# Altium project FDRV_1.0.PrjPCB
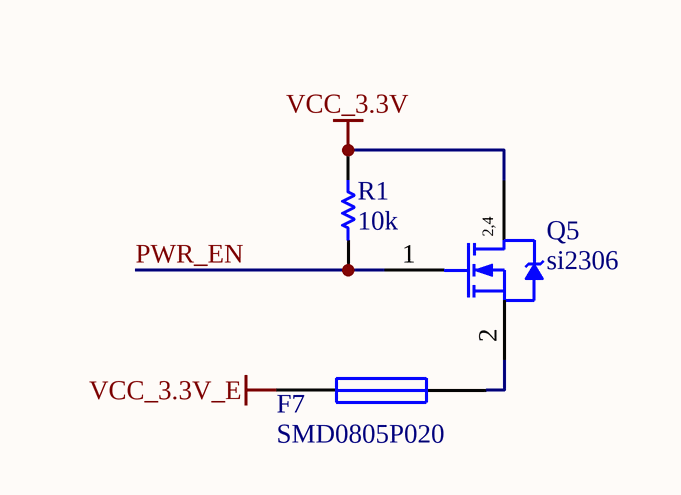
[diagram p0: Connector.SchDoc]
5 sheets, 72 parts. Net scope: global (net labels, ports and power ports of the same name join across sheets).
Board file: PCB1.PcbDoc
Sheets:
  Connector.SchDoc
  cpu.SchDoc
  RS485.SchDoc
  Humidifier.SchDoc
  POWER.SchDoc

## Sheet Connector.SchDoc
size A3

### Parts
F7  SMD0805P020  [1206R]
Q5  si2306  [SOT23-3]
R1  10k  [0603r]

### Nets
VCC_3.3V: Q5.3(D) R1.1
VCC_3.3V_E: F7.1
PWR_EN: Q5.1(G) R1.2
NetF7_2: F7.2 Q5.2(S)

### Notes on the sheet
- (in symbol BUK92150-55A) 2,4

### Library data of the parts
F7 = Fuse 1: Fuse; Published: 8-Jun-2000; LatestRevisionDate: 17-Jul-2002; LatestRevisionNote: Re-released for DXP Platform.; PackageReference: PIN-W2/E2.8; Publisher: Altium Limited
Q5 = BUK92150-55A: Published: 8-Jun-2000; LatestRevisionDate: 17-Jul-2002; LatestRevisionNote: Re-released for DXP Platform.; DatasheetVersion: 6-Oct-1997; PackageVersion: Aug-1998; PackageReference: TSOP-6; Publisher: Altium Limited; PackageDescription: SOT-457/SC-74; 6 Leads; Body 3.1 x 3 mm, inc. leads (LxW max); ComponentLink1Description: Manufacturer Link; ComponentLink1URL: http://www.vishay.com/; ComponentLink2Description: Datasheet; ComponentLink2URL: http://www.vishay.com/docs/70192/70192.pdf
R1 = Res1: Resistor; Value: 1K; Published: 8-Jun-2000; LatestRevisionDate: 17-Jul-2002; LatestRevisionNote: Re-released for DXP Platform.; PackageReference: AXIAL-0.3; Publisher: Altium Limited

## Sheet cpu.SchDoc
size A3
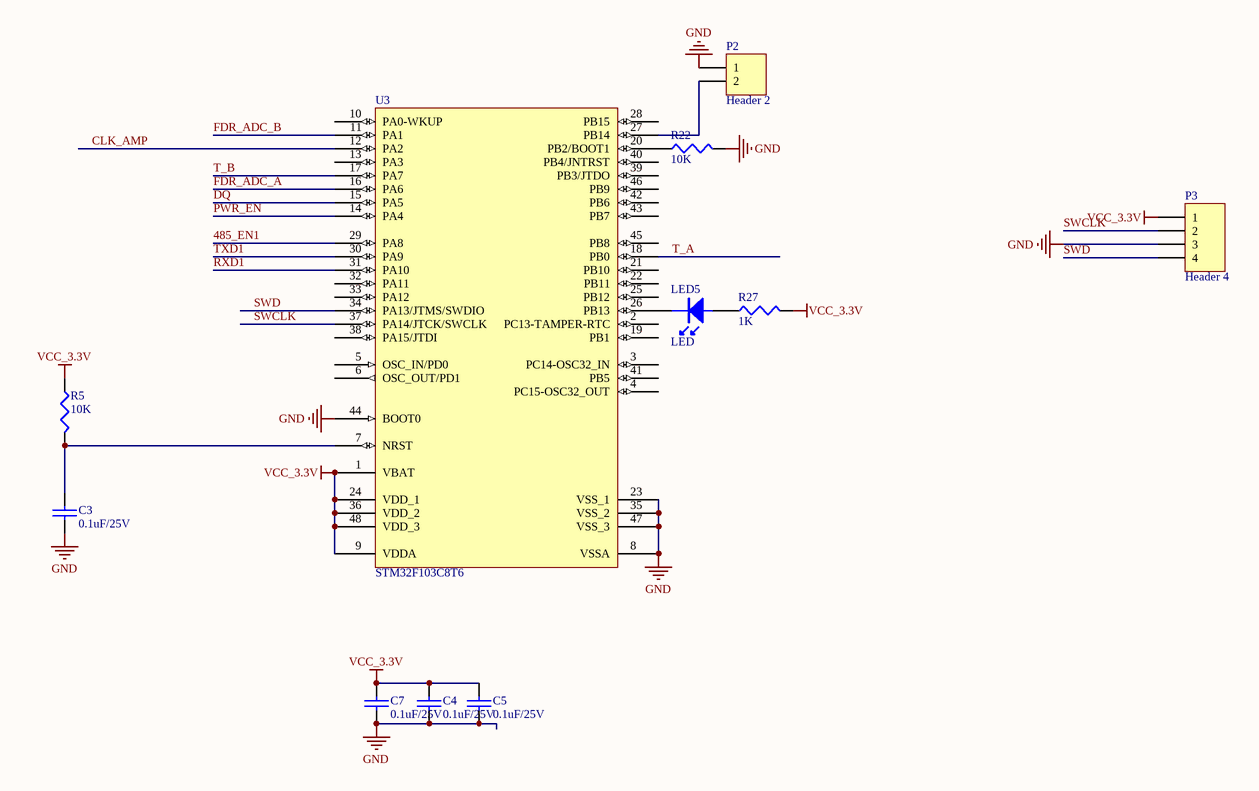
[diagram p1: cpu.SchDoc]

### Parts
C3  0.1uF/25V  [0603C]
C4  0.1uF/25V  [0603C]
C5  0.1uF/25V  [0603C]
C7  0.1uF/25V  [0603C]
LED5  LED  [0603LED]
P2  Header 2  [HDR1X2]
P3  Header 4  [HDR1X4]
R5  10K  [0603R]
R22  10K  [0603R]
R27  1K  [0603R]
U3  STM32F103C8T6  [TQFP-48]

### Nets
GND: C3.1 C4.1 C5.1 C7.1 P2.1 P3.3 R22.2 U3.8(VSSA) U3.23(VSS_1) U3.35(VSS_2) U3.44(BOOT0) U3.47(VSS_3)  [project net AGND]
VCC_3.3V: C4.2 C5.2 C7.2 P3.1 R5.1 R27.2 U3.1(VBAT) U3.9(VDDA) U3.24(VDD_1) U3.36(VDD_2) U3.48(VDD_3)
485_EN1: U3.29(PA8)
CLK_AMP: U3.12(PA2)
DQ: U3.15(PA5)
FDR_ADC_A: U3.16(PA6)
FDR_ADC_B: U3.11(PA1)
PWR_EN: U3.14(PA4)
RXD1: U3.31(PA10)
SWCLK: P3.2 U3.37(PA14/JTCK/SWCLK)
SWD: P3.4 U3.34(PA13/JTMS/SWDIO)
T_A: U3.18(PB0)
T_B: U3.17(PA7)
TXD1: U3.30(PA9)
NetC3_2: C3.2 R5.2 U3.7(NRST)
NetLED5_1: LED5.1 R27.1
NetLED5_2: LED5.2 U3.26(PB13)
NetP2_2: P2.2 U3.27(PB14)
NetR22_1: R22.1 U3.20(PB2/BOOT1)

Not connected (* = marked no-connect by the designer): U3 2(PC13-TAMPER-RTC) 3(PC14-OSC32_IN) 4(PC15-OSC32_OUT) 5(OSC_IN/PD0) 6(OSC_OUT/PD1) 10(PA0-WKUP) 13(PA3) 19(PB1) 21(PB10) 22(PB11) 25(PB12) 28(PB15) 32(PA11) 33(PA12) 38(PA15/JTDI) 39(PB3/JTDO) 40(PB4/JNTRST) 41(PB5) 42(PB6) 43(PB7) 45(PB8) 46(PB9)

### Library data of the parts
C3-C5 C7 = CAP: Capacitor
P2 = Header 2: Header, 2-Pin; LatestRevisionDate: 17-Jul-2002; LatestRevisionNote: Re-released for DXP Platform.; Publisher: Altium Limited
P3 = Header 4: Header, 4-Pin; LatestRevisionDate: 17-Jul-2002; LatestRevisionNote: Re-released for DXP Platform.; Publisher: Altium Limited
R5 R22 = Res3: Resistor; Published: 8-Jun-2000; LatestRevisionDate: 29-May-2009; LatestRevisionNote: IPC-7351 Footprint Added.; PackageReference: J1-0603; Publisher: Altium Limited; PackageDescription: Chip Resistor
R27 = RES1: P: 1/8W
U3 = STM32F103C8T6: STM32 ARM-based 32-bit MCU with 64 Kbytes Flash, 48-pin LQFP, Industrial Temperature; Published: 30-May-2008; DatasheetVersion: rev6, Mar-2008; PackageVersion: Mar-2008; PackageReference: LQFP48; Publisher: Altium Limited; PackageDescription: 48-Pin Low-Profile Quad Flat Pack, 7 x 7 mm Body, 0.5 mm Pitch (LQFP48); ComponentLink1Description: Manufacturer Link; ComponentLink1URL: www.st.com/stm32; ComponentLink2Description: Datasheet; ComponentLink2URL: http://www.st.com/stonline/products/literature/ds/13587.pdf

## Sheet RS485.SchDoc
size A4
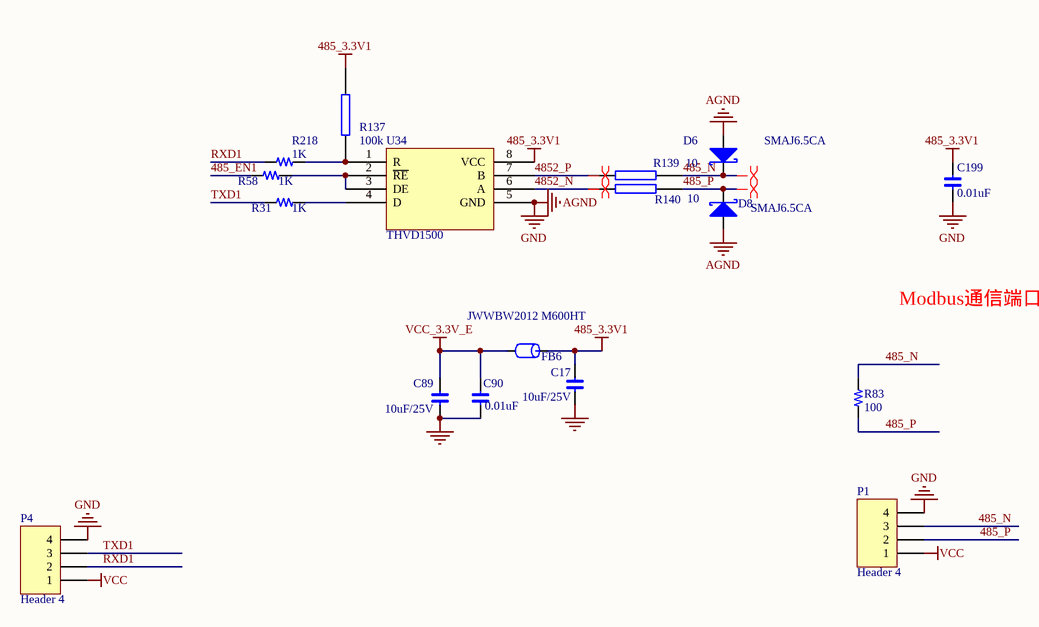
[diagram p2: RS485.SchDoc]

### Parts
C17  10uF/25V  [0603C]
C89  10uF/25V  [0603C]
C90  0.01uF  [0603C]
C199  0.01uF  [0603C]
D6  SMAJ6.5CA  [SMA]
D8  SMAJ6.5CA  [SMA]
FB6  JWWBW2012 M600HT  [0805CZ]
P1  Header 4  [HDR1X4]
P4  Header 4  [HDR1X4]
R31  1K  [0603R]
R58  1K  [0603R]
R83  100  [0603R]
R137  100k  [0603R]
R139  10  [1206R]
R140  10  [1206R]
R218  1K  [0603R]
U34  THVD1500  [so-8]

### Nets
485_3.3V1: C17.2 C199.2 FB6.1 R137.2 U34.8(VCC)
AGND: C17.1 C89.1 C90.1 C199.1 D6.1(A) D8.1(A) P1.4 P4.4 U34.5(GND)  [also labelled GND]
VCC: P1.1 P4.1
VCC_3.3V_E: C89.2 C90.2 FB6.2
485_EN1: R58.2
485_N: D6.2(K) P1.3 R83.2 R139.1
485_P: D8.2(K) P1.2 R83.1 R140.1
4852_N: R140.2 U34.6(A)
4852_P: R139.2 U34.7(B)
RXD1: P4.2 R218.2
TXD1: P4.3 R31.2
NetR31_1: R31.1 U34.4(D)
NetR58_1: R58.1 U34.2(~{RE}) U34.3(DE)
NetR137_1: R137.1 R218.1 U34.1(R)

### Layout directives
differential pair: 485_N, 485_P, 4852_N, 4852_P

### Notes on the sheet
- Modbus通信端口

### Library data of the parts
C17 C89 C90 C199 = C
D6 D8 = DIODE S: Schottky Diode
FB6 = FB: Part Field 1: 磁珠/0603/1K ohm/100MHz; FB: BLM18BD102SN1(muRata); Text Field1: FB
P1 P4 = Header 4: Header, 4-Pin; LatestRevisionDate: 17-Jul-2002; LatestRevisionNote: Re-released for DXP Platform.; Publisher: Altium Limited
R31 R58 R83 R218 = R
R137 R139 R140 = RES2
U34 = SN65HVD06D

## Sheet Humidifier.SchDoc
size A2; PageSetup: Record=PageOptions|CenterHorizontal=True|CenterVertical=True|PrintScale=1.00|XCorrection=1.00|YCorrection=1.00|PrintKind=0|BorderSize=5000000|LeftOffset=0|BottomOffset=0|Orientation=2|PaperLength=1000|PaperWidth=1000|Scale=100|PaperSource=7|PrintQuality=-4|MediaType=1|DitherType=10|PaperKind=A4|PrintScaleMode=1
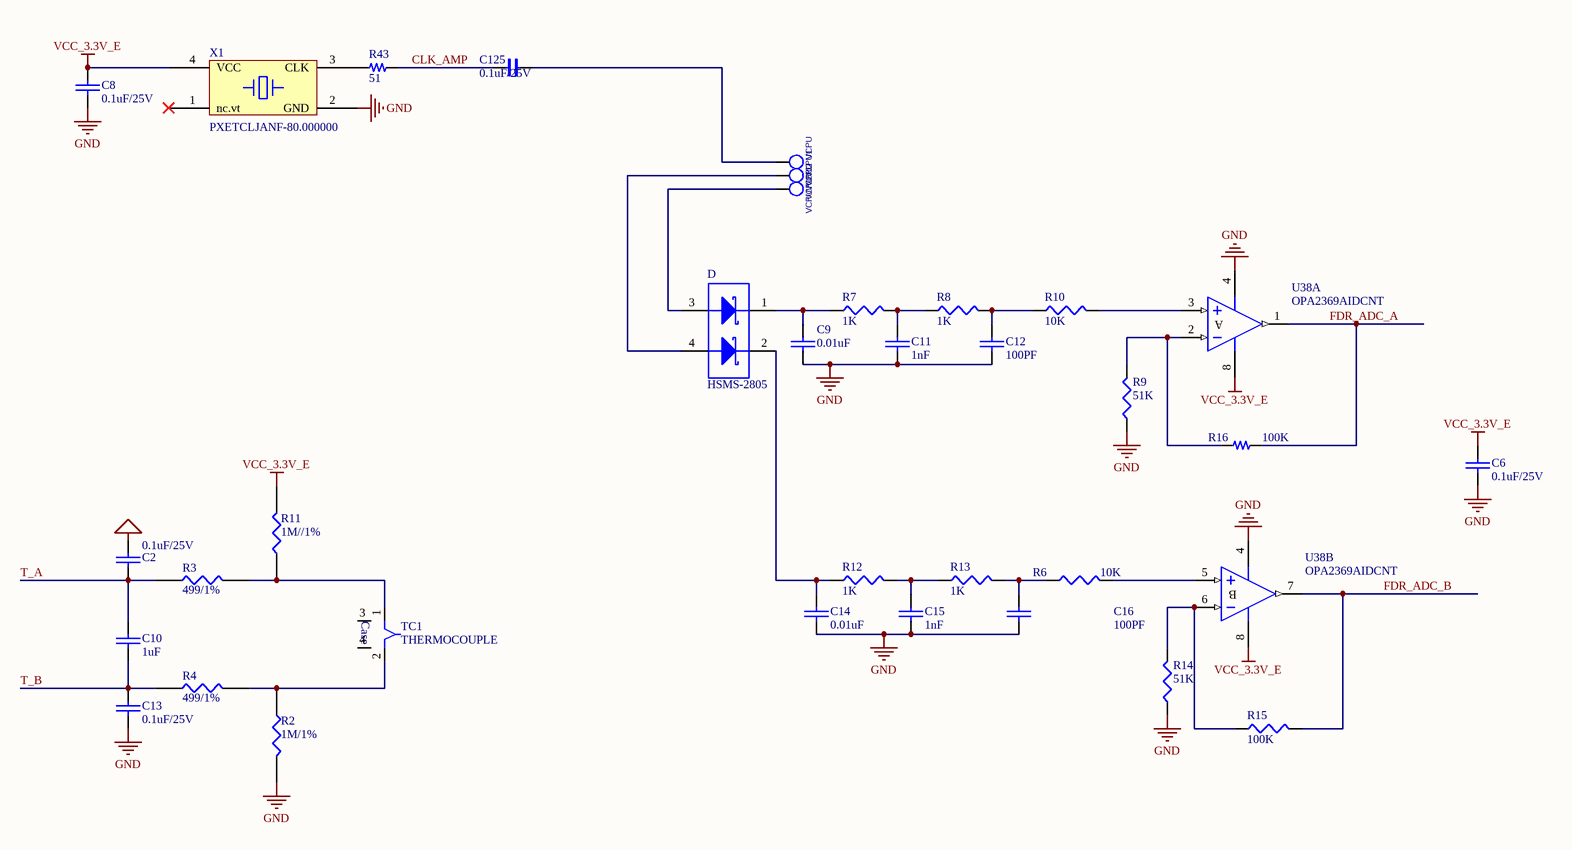
[diagram p3: Humidifier.SchDoc]

### Parts
C2  0.1uF/25V  [0603c]
C6  0.1uF/25V  [0603C]
C8  0.1uF/25V  [0603C]
C9  0.01uF  [0603C]
C10  1uF  [0603c]
C11  1nF  [0603C]
C12  100PF  [0603C]
C13  0.1uF/25V  [0603c]
C14  0.01uF  [0603C]
C15  1nF  [0603C]
C16  100PF  [0603C]
C125  0.1uF/25V  [0603C]
D  HSMS-2805  [HSMS-2805]
R2  1M/1%  [0603r]
R3  499/1%  [0603r]
R4  499/1%  [0603r]
R6  10K  [0603R]
R7  1K  [0603R]
R8  1K  [0603R]
R9  51K  [0603R]
R10  10K  [0603R]
R11  1M//1%  [0603r]
R12  1K  [0603R]
R13  1K  [0603R]
R14  51K  [0603R]
R15  100K  [0603R]
R16  100K  [0603R]
R43  51  [0603r]
TC1  THERMOCOUPLE  [0603R]
U38  OPA2369AIDCNT  [OPA2369AIDCNT]  (parts A,B of 2)
VCPU  VCPU  [probe]
VCPU1  VCPU  [probe]
VCPU2  VCPU  [probe]
X1  PXETCLJANF-80.000000  [XTAL4TN_7050]

### Nets
GND: C2.2 C6.1 C8.2 C9.2 C11.2 C12.2 C13.2 C14.2 C15.2 C16.2 R2.2 R9.1 R14.1 U38.4(V-) X1.2(GND)  [project net AGND]
VCC_3.3V_E: C6.2 C8.1 R11.2 U38.8(V+) X1.4(VCC)
CLK_AMP: C125.1 R43.2
FDR_ADC_A: R16.2 U38.1(OUT)
FDR_ADC_B: R15.2 U38.7(OUT)
T_A: C2.1 C10.1 R3.1
T_B: C10.2 C13.1 R4.1
NetC9_1: C9.1 D.1(K) R7.1
NetC11_1: C11.1 R7.2 R8.1
NetC12_1: C12.1 R8.2 R10.1
NetC14_1: C14.1 D.2(K) R12.1
NetC15_1: C15.1 R12.2 R13.1
NetC16_1: C16.1 R6.1 R13.2
NetC125_2: C125.2 VCPU.1(TP)
NetD_3: D.3(A) VCPU2.1(TP)
NetD_4: D.4(A) VCPU1.1(TP)
NetR2_1: R2.1 R4.2 TC1.2
NetR3_2: R3.2 R11.1 TC1.1
NetR6_2: R6.2 U38.5(IN+)
NetR9_2: R9.2 R16.1 U38.2(IN-)
NetR10_2: R10.2 U38.3(IN+)
NetR14_2: R14.2 R15.1 U38.6(IN-)
NetR43_1: R43.1 X1.3(CLK)

Not connected (* = marked no-connect by the designer): TC1 3 4; X1 1(nc.vt)*

### Notes on the sheet
- (in symbol LM2904D, part A) A
- (in symbol LM2904D, part B) B
- (in symbol THERMOCOUPLE) Case

### Library data of the parts
C2 C6 C8-C16 = CAP: Capacitor
C125 = C
R2-R4 R11 = RES1
R6-R10 R12-R15 = Res3: Resistor; Published: 8-Jun-2000; LatestRevisionDate: 29-May-2009; LatestRevisionNote: IPC-7351 Footprint Added.; PackageReference: J1-0603; Publisher: Altium Limited; PackageDescription: Chip Resistor
R16 R43 = R
U38 = LM2904D: Dual Operational Amplifier; Published: 16-Jan-2001; LatestRevisionDate: 13-Apr-2006; LatestRevisionNote: IPC-7351 Footprint Added.; DatasheetVersion: Jul-1998; PackageVersion: Jan-1998; PackageReference: D008; Publisher: Altium Limited; PackageDescription: 8-Pin Small Outline Integrated Circuit 1.27 mm Pitch; Code_IPC: SOIC127P600-8; ComponentLink1Description: Manufacturer Link; ComponentLink1URL: http://www.ti.com/; ComponentLink2Description: Datasheet; ComponentLink2URL: http://www-s.ti.com/sc/ds/lm2904.pdf
VCPU VCPU1 VCPU2 = T_POINT_R
X1 = XTAL4S

## Sheet POWER.SchDoc
size A3
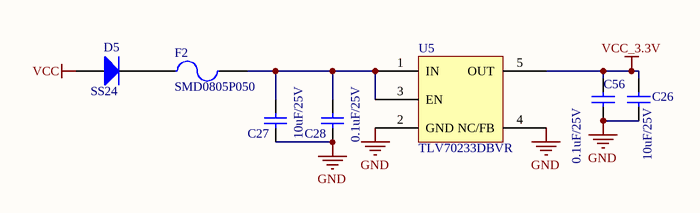
[diagram p4: POWER.SchDoc]

### Parts
C26  10uF/25V  [0603C]
C27  10uF/25V  [0603C]
C28  0.1uF/25V  [0603C]
C56  0.1uF/25V  [0603C]
D5  SS24  [SMA]
F2  SMD0805P050  [0805R]
U5  TLV70233DBVR  [SOT23-5(DBV)]

### Nets
GND: C26.1 C27.1 C28.2 C56.2 U5.2(GND) U5.4(NC/FB)  [project net AGND]
VCC: D5.1(A)
VCC_3.3V: C26.2 C56.1 U5.5(OUT)
NetC27_2: C27.2 C28.1 F2.2 U5.1(IN) U5.3(EN)
NetD5_2: D5.2(K) F2.1

### Library data of the parts
C26 = Cap: Capacitor; Value: 10uF/10V; Published: 8-Jun-2000; LatestRevisionDate: 17-Jul-2002; LatestRevisionNote: Re-released for DXP Platform.; PackageReference: RAD-0.3; Publisher: Altium Limited
C27 = Cap: Capacitor; Value: 106/50V; Published: 8-Jun-2000; LatestRevisionDate: 17-Jul-2002; LatestRevisionNote: Re-released for DXP Platform.; PackageReference: RAD-0.3; Publisher: Altium Limited
C28 C56 = Cap: Capacitor; Value: 104; Published: 8-Jun-2000; LatestRevisionDate: 17-Jul-2002; LatestRevisionNote: Re-released for DXP Platform.; PackageReference: RAD-0.3; Publisher: Altium Limited
D5 = Diode 1N4148: High Conductance Fast Diode; Published: 8-Jun-2000; LatestRevisionDate: 17-Jul-2002; LatestRevisionNote: Re-released for DXP Platform.; DatasheetVersion: 1997; PackageReference: DO-35; Publisher: Altium Limited; Code_JEDEC: DO-204-AH; ComponentLink1Description: Manufacturer Link; ComponentLink1URL: http://www.fairchildsemi.com/; ComponentLink2Description: Datasheet; ComponentLink2URL: http://www.fairchildsemi.com/ds/1N%2F1N4148.pdf
F2 = Fuse 2: Fuse; Published: 8-Jun-2000; LatestRevisionDate: 17-Jul-2002; LatestRevisionNote: Re-released for DXP Platform.; PackageReference: PIN-W2/E2.8; Publisher: Altium Limited
U5 = TLV70230DBVR

## Nets that join several sheets
AGND: cpu (12 pins), RS485 (9 pins), Humidifier (15 pins), POWER (6 pins)
VCC: RS485 (P1.1 P4.1), POWER (D5.1)
VCC_3.3V: Connector (Q5.3 R1.1), cpu (11 pins), POWER (C26.2 C56.1 U5.5)
VCC_3.3V_E: Connector (F7.1), RS485 (C89.2 C90.2 FB6.2), Humidifier (5 pins)
485_EN1: cpu (U3.29), RS485 (R58.2)
CLK_AMP: cpu (U3.12), Humidifier (C125.1 R43.2)
FDR_ADC_A: cpu (U3.16), Humidifier (R16.2 U38.1)
FDR_ADC_B: cpu (U3.11), Humidifier (R15.2 U38.7)
PWR_EN: Connector (Q5.1 R1.2), cpu (U3.14)
RXD1: cpu (U3.31), RS485 (P4.2 R218.2)
T_A: cpu (U3.18), Humidifier (C2.1 C10.1 R3.1)
T_B: cpu (U3.17), Humidifier (C10.2 C13.1 R4.1)
TXD1: cpu (U3.30), RS485 (P4.3 R31.2)